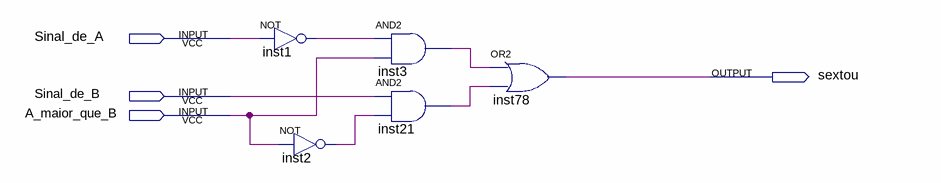
[diagram p0: schematic sheet]
// Quartus schematic comparador_maior_sinal.bdf as structural Verilog: 5 symbols, 4 pins
module comparador_maior_sinal (
  input  Sinal_de_A,
  input  Sinal_de_B,
  input  A_maior_que_B,
  output sextou
);

  wire inst1_out, inst2_out, inst3_out, inst21_out;

  not inst1 (inst1_out, Sinal_de_A);
  not inst2 (inst2_out, A_maior_que_B);
  and inst3 (inst3_out, inst1_out, A_maior_que_B);
  and inst21 (inst21_out, Sinal_de_B, inst2_out);
  or inst78 (sextou, inst3_out, inst21_out);
endmodule
